# Altium project ST-Link V2.PrjPCB
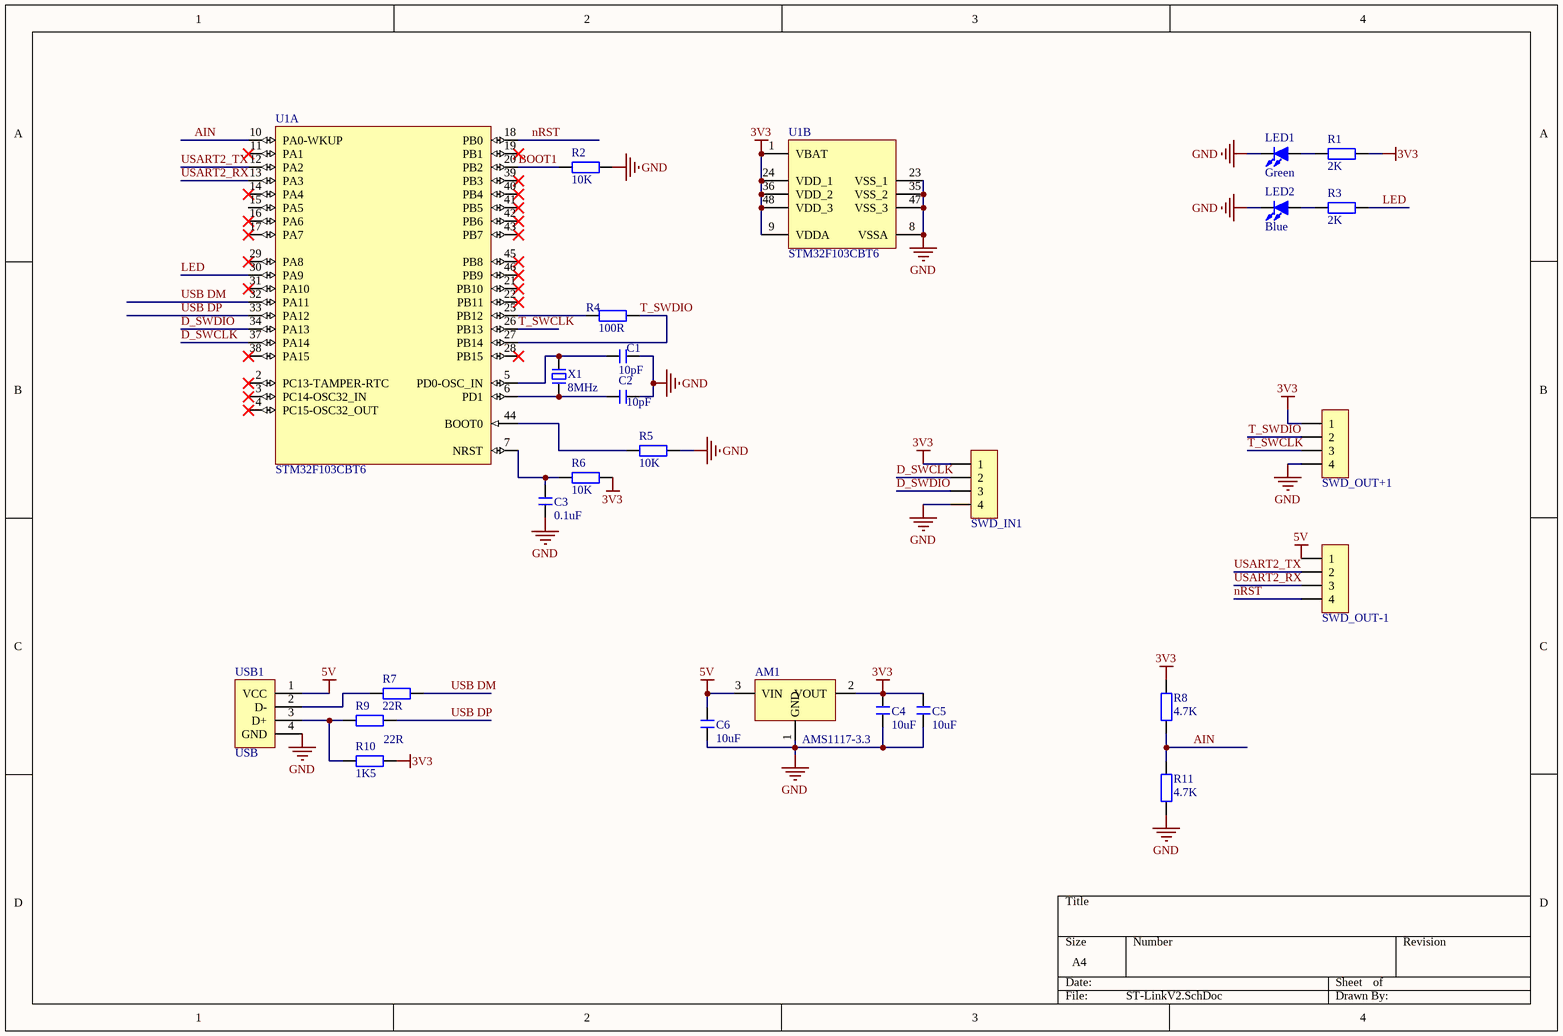
[diagram p0: ST-LinkV2.SchDoc]
1 sheet, 26 parts. Net scope: global (net labels, ports and power ports of the same name join across sheets).
Board file: ST-Link V2.PcbDoc

## Sheet ST-LinkV2.SchDoc
size A4

### Parts
AM1  AMS1117-3.3  [SOT89_M]
C1  10pF  [C 0402_M]
C2  10pF  [C 0402_M]
C3  0.1uF  [C 0402_M]
C4  10uF  [C 0603_M]
C5  10uF  [C 0603_M]
C6  10uF  [C 0402_M]
LED1  Green  [LED 0603G]
LED2  Blue  [LED 0603B]
R1  2K  [R 0402_L]
R2  10K  [R 0402_L]
R3  2K  [R 0402_L]
R4  100R  [R 0402_L]
R5  10K  [R 0402_L]
R6  10K  [R 0402_L]
R7  22R  [R 0402_L]
R8  4.7K  [R 0402_L]
R9  22R  [R 0402_L]
R10  1K5  [R 0402_L]
R11  4.7K  [R 0402_L]
SWD_IN1  HDR-1X4  [HDR2.54-LI-4P]  (value not drawn)
SWD_OUT+1  HDR-1X4  [HDR2.54-WS-4P]  (value not drawn)
SWD_OUT-1  HDR-1X4  [HDR2.54-WS-4P]  (value not drawn)
U1  STM32F103CBT6  [LQFP48_N]  (parts A,B of 2)
USB1  USB  [USB_A/P_A]
X1  8MHz  [OSC HC-49S]

### Nets
3V3: AM1.2(VOUT) C4.1 C5.1 R1.2 R6.2 R8.2 R10.1 SWD_IN1.1 SWD_OUT+1.1 U1.1(VBAT) U1.9(VDDA) U1.24(VDD_1) U1.36(VDD_2) U1.48(VDD_3)
5V: AM1.3(VIN) C6.1 SWD_OUT-1.1 USB1.1(VCC)
GND: AM1.1(GND) C1.1 C2.1 C3.1 C4.2 C5.2 C6.2 LED1.2(K) LED2.2(K) R2.2 R5.2 R11.1 SWD_IN1.4 SWD_OUT+1.4 U1.8(VSSA) U1.23(VSS_1) U1.35(VSS_2) U1.47(VSS_3) USB1.4(GND)
AIN: R8.1 R11.2 U1.10(PA0-WKUP)
BOOT1: R2.1 U1.20(PB2)
D_SWCLK: SWD_IN1.2 U1.37(PA14)
D_SWDIO: SWD_IN1.3 U1.34(PA13)
LED: R3.2 U1.30(PA9)
nRST: SWD_OUT-1.4 U1.18(PB0)
T_SWCLK: SWD_OUT+1.3 U1.26(PB13)
T_SWDIO: R4.2 SWD_OUT+1.2 U1.27(PB14)
USART2_RX: SWD_OUT-1.3 U1.13(PA3)
USART2_TX: SWD_OUT-1.2 U1.12(PA2)
USB DM: R7.2 U1.32(PA11)
USB DP: R9.2 U1.33(PA12)
NetC1_2: C1.2 U1.5(PD0-OSC_IN) X1.2
NetC2_2: C2.2 U1.6(PD1) X1.1
NetC3_2: C3.2 R6.1 U1.7(NRST)
NetLED1_1: LED1.1(A) R1.1
NetLED2_1: LED2.1(A) R3.1
NetR4_1: R4.1 U1.25(PB12)
NetR5_1: R5.1 U1.44(BOOT0)
NetR7_1: R7.1 USB1.2(D-)
NetR9_1: R9.1 R10.2 USB1.3(D+)

Not connected (* = marked no-connect by the designer): U1 2(PC13-TAMPER-RTC)* 3(PC14-OSC32_IN)* 4(PC15-OSC32_OUT)* 11(PA1)* 14(PA4)* 15(PA5) 16(PA6)* 17(PA7)* 19(PB1)* 21(PB10)* 22(PB11)* 28(PB15)* 29(PA8)* 31(PA10)* 38(PA15)* 39(PB3)* 40(PB4)* 41(PB5)* 42(PB6)* 43(PB7)* 45(PB8)* 46(PB9)*

### Library data of the parts
C1-C6 = C: 贴片电容; BOM名称: 无极性贴片电容; 封装库来自淘宝卖家 ID：黄晶宝石: 其他店铺购入均为盗版假冒封装库; 联系卖家，免费查找封装: 唯一出售店铺网址https://shop463601444.taobao.com
LED1 LED2 = LED-SMD: 贴片LED; 封装库来自淘宝卖家 ID：黄晶宝石: 其他店铺购入均为假冒，请立即申请退款，本店奖励2~5元现金; 卖家免费查找封装，联系售后: 唯一出售店铺网址https://shop463601444.taobao.com; BOM名称: 贴片LED
R1-R11 = R: 贴片电阻; 封装库来自淘宝卖家 ID：黄晶宝石: 其他店铺购入均为盗版假冒封装库; 联系卖家，免费查找封装: 唯一出售店铺网址https://shop463601444.taobao.com; BOM名称: 贴片电阻
SWD_IN1 SWD_OUT+1 SWD_OUT-1 = Header 4: 4P接插件; 封装库来自淘宝卖家  ID：黄晶宝石: 其他店铺购入均为盗版假冒封装库，请立即申请退款; 技术支持， 联系售后: 唯一出售店铺网址https://shop463601444.taobao.com; BOM名称: 4P接插件
U1 = STM32F103CBT6: STM32 ARM-based 32-bit MCU Performance Line with 128 kB Flash, 20 kB Internal RAM, -40 to +85癈 Temperature, 48-Pin LQFP, Tray; 优秀评价可免费更新: 联系淘宝ID：黄晶宝石，获取更新版封装库; 卖家免费技术支持，联系售后: 唯一出售店铺网址https://shop463601444.taobao.com; 封装库来自淘宝卖家 ID：黄晶宝石: 其他店铺购入均为假冒，请申请退款，本店现金奖励; DatasheetVersion: rev13.0, Apr-2011; PackageVersion: rev13, Apr-2011; PackageReference: LQFP48; PackageDescription: 48-Pin Low-Profile Quad Flat Pack, 7 x 7 mm Body, 0.5 mm Pitch (LQFP48)
USB1 = USB-A/P: USB-A型公接口; 封装库来自淘宝卖家 ID：黄晶宝石: 其他店铺购入均为盗版假冒封装库，请立即申请退款，本店3~10元现金奖励; 卖家免费查找封装，联系售后: 唯一出售店铺网址https://shop463601444.taobao.com; BOM名称: USB-A型公接口
X1 = XTAL-2P: 2脚无源脚晶振; 免费技术支持，联系售后: 唯一出售店铺网址https://shop463601444.taobao.com; 封装库来自淘宝卖家  ID：黄晶宝石: 其他店铺购入均为盗版假冒封装库，请立即申请退款，本店3~10元现金奖励; BOM名称: 2脚无源脚晶振